# Altium schematic sheet MCU.SchDoc
size A
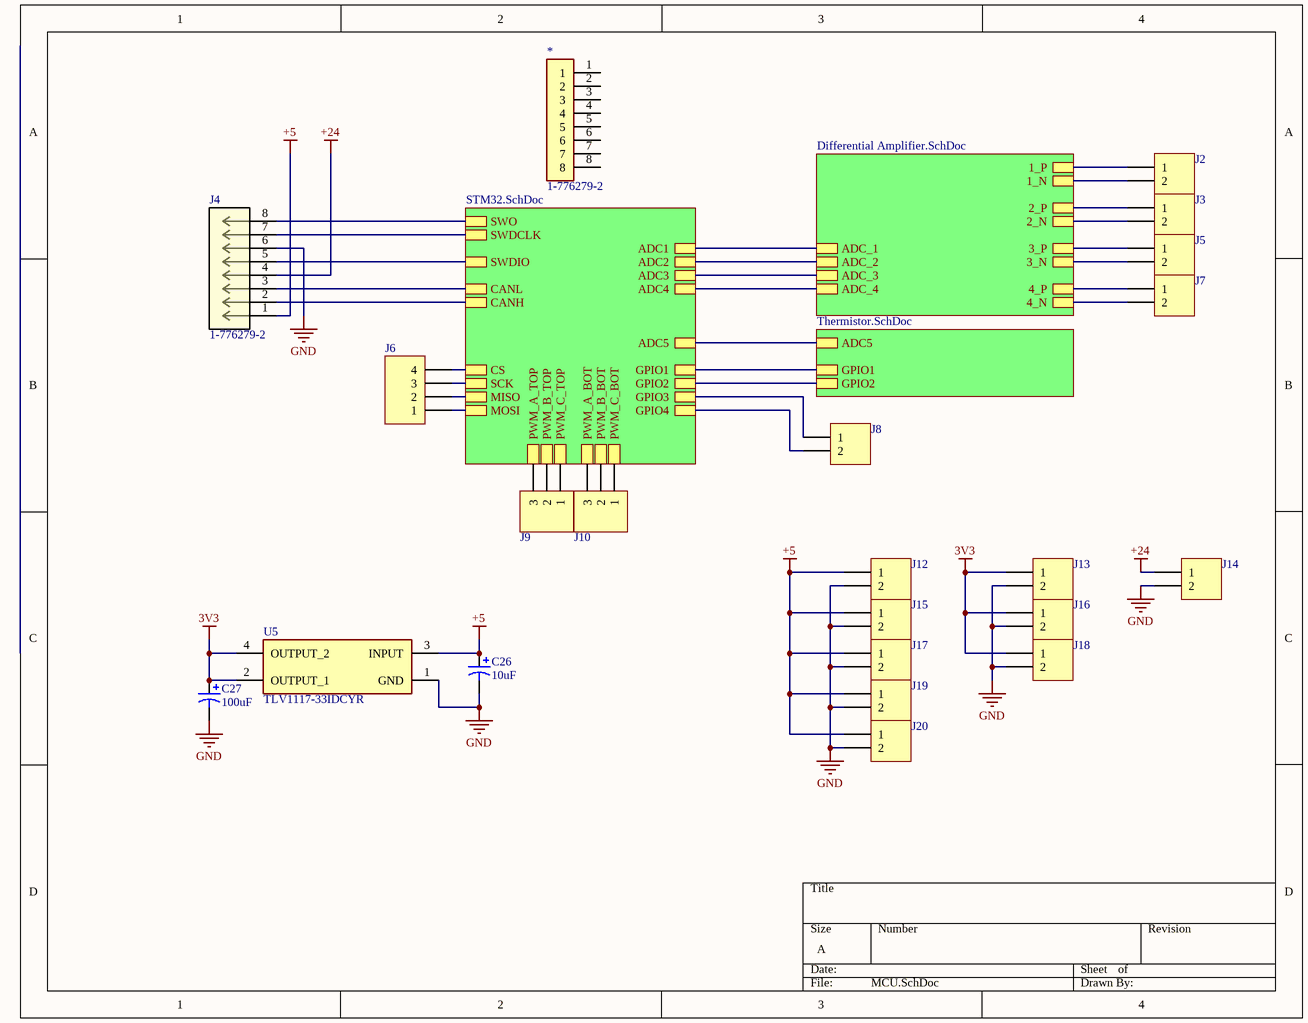
[diagram p0: MCU.SchDoc]

## Parts
*  1-776279-2  [TE_1-776279-2]
C26  value 10uF  [CAPAE660X800N]  (hidden comment: Cap Pol3)
C27  value 100uF  [CAPAE660X800N]  (hidden comment: Cap Pol3)
J2  Header 2  [HDR1X2]  (value not drawn)
J3  Header 2  [HDR1X2]  (value not drawn)
J4  1-776279-2  [CONN8_776279_TEC]
J5  Header 2  [HDR1X2]  (value not drawn)
J6  Header 4  [HDR1X4]  (value not drawn)
J7  Header 2  [HDR1X2]  (value not drawn)
J8  Header 2  [HDR1X2]  (value not drawn)
J9  Header 3  [HDR1X3]  (value not drawn)
J10  Header 3  [HDR1X3]  (value not drawn)
J12  Header 2  [HDR1X2]  (value not drawn)
J13  Header 2  [HDR1X2]  (value not drawn)
J14  Header 2  [HDR1X2]  (value not drawn)
J15  Header 2  [HDR1X2]  (value not drawn)
J16  Header 2  [HDR1X2]  (value not drawn)
J17  Header 2  [HDR1X2]  (value not drawn)
J18  Header 2  [HDR1X2]  (value not drawn)
J19  Header 2  [HDR1X2]  (value not drawn)
J20  Header 2  [HDR1X2]  (value not drawn)
U5  TLV1117-33IDCYR  [SOT230P700X180-4N]

## Sub-sheets
Designator = STM32.SchDoc: ADC1, ADC2, ADC3, ADC4, ADC5, CANH, CANL, GPIO1, GPIO4, GPIO3, GPIO2, PWM_B_BOT, PWM_A_BOT, PWM_B_TOP, PWM_C_BOT, PWM_A_TOP, PWM_C_TOP, CS, MISO, SCK, MOSI, SWDIO, SWO, SWDCLK
Designator = Differential Amplifier.SchDoc: ADC_1, ADC_2, ADC_3, ADC_4, 2_N, 2_P, 3_N, 1_N, 4_P, 1_P, 4_N, 3_P
Designator = Thermistor.SchDoc: ADC5, GPIO1, GPIO2

## Nets
3V3: C27.1 J13.1 J16.1 J18.1 U5.2(OUTPUT_1) U5.4(OUTPUT_2)
+5: C26.1 J4.1 J12.1 J15.1 J17.1 J19.1 J20.1 U5.3(INPUT)
+24: J4.4 J14.1
GND: C26.2 C27.2 J4.6 J12.2 J13.2 J14.2 J15.2 J16.2 J17.2 J18.2 J19.2 J20.2 U5.1(GND)
NetJ2_1: J2.1 ; sheet Designator/1_P
NetJ2_2: J2.2 ; sheet Designator/1_N
NetJ3_1: J3.1 ; sheet Designator/2_P
NetJ3_2: J3.2 ; sheet Designator/2_N
NetJ4_2: J4.2 ; sheet Designator/CANH
NetJ4_3: J4.3 ; sheet Designator/CANL
NetJ4_5: J4.5 ; sheet Designator/SWDIO
NetJ4_7: J4.7 ; sheet Designator/SWDCLK
NetJ4_8: J4.8 ; sheet Designator/SWO
NetJ5_1: J5.1 ; sheet Designator/3_P
NetJ5_2: J5.2 ; sheet Designator/3_N
NetJ6_1: J6.1 ; sheet Designator/MOSI
NetJ6_2: J6.2 ; sheet Designator/MISO
NetJ6_3: J6.3 ; sheet Designator/SCK
NetJ6_4: J6.4 ; sheet Designator/CS
NetJ7_1: J7.1 ; sheet Designator/4_P
NetJ7_2: J7.2 ; sheet Designator/4_N
NetJ8_1: J8.1 ; sheet Designator/GPIO3
NetJ8_2: J8.2 ; sheet Designator/GPIO4
NetJ9_1: J9.1 ; sheet Designator/PWM_C_TOP
NetJ9_2: J9.2 ; sheet Designator/PWM_B_TOP
NetJ9_3: J9.3 ; sheet Designator/PWM_A_TOP
NetJ10_1: J10.1 ; sheet Designator/PWM_C_BOT
NetJ10_2: J10.2 ; sheet Designator/PWM_B_BOT
NetJ10_3: J10.3 ; sheet Designator/PWM_A_BOT
(unnamed): sheet Designator/ADC1, sheet Designator/ADC_1
(unnamed): sheet Designator/ADC2, sheet Designator/ADC_2
(unnamed): sheet Designator/ADC3, sheet Designator/ADC_3
(unnamed): sheet Designator/ADC4, sheet Designator/ADC_4
(unnamed): sheet Designator/ADC5, sheet Designator/ADC5
(unnamed): sheet Designator/GPIO1, sheet Designator/GPIO1
(unnamed): sheet Designator/GPIO2, sheet Designator/GPIO2

Not connected (* = marked no-connect by the designer): * 1 2 3 4 5 6 7 8

## Library data of the parts
C26 C27 = Cap Pol3: Polarized Capacitor (Surface Mount); Published: 8-Jun-2000; LatestRevisionDate: 29-May-2009; LatestRevisionNote: IPC-7351 Footprint Added.; PackageReference: C0805; Publisher: Altium Limited; PackageDescription: Chip Capacitor
J2 J3 J5 J7 J8 J12-J20 = Header 2: Header, 2-Pin; LatestRevisionDate: 17-Jul-2002; LatestRevisionNote: Re-released for DXP Platform.; Publisher: Altium Limited
J4 = 1-776279-2: 8 POS RIGHT ANGLE HEADER ASSY; Vendor: TE Connectivity; ROWS/CONFIG: 3; PITCH(MM): 0.157; POSITIONS: 8; Built_By: EMA_UL_Team; SourceLibrary: TE_Connectivity-2018-03-16; Copyright: Copyright (C) 2016 Accelerated Designs. All rights reserved; Manufacturer_Part_Number: 1-776279-2; TE_Part_Number: 1-776279-2; PRODUCT: -; Type: DEV; RefDes: RefDes
J6 = Header 4: Header, 4-Pin; LatestRevisionDate: 17-Jul-2002; LatestRevisionNote: Re-released for DXP Platform.; Publisher: Altium Limited
J9 J10 = Header 3: Header, 3-Pin; LatestRevisionDate: 17-Jul-2002; LatestRevisionNote: Re-released for DXP Platform.; Publisher: Altium Limited
U5 = TLV1117-33IDCYR: Integrated Circuit; Manufacturer_Name: Texas Instruments; Datasheet Link: http://www.ti.com/lit/ds/symlink/tlv1117.pdf?HQS=TI-null-null-digikeymode-df-pf-null-wwe&ts=1590668900314; Height: 1.8mm; Manufacturer_Part_Number: TLV1117-33IDCYR; Arrow Part Number: TLV1117-33IDCYR; Arrow Price/Stock: https://www.arrow.com/en/products/tlv1117-33idcyr/texas-instruments; Mouser Part Number: 595-TLV1117-33IDCYR; Mouser Price/Stock: https://www.mouser.co.uk/ProductDetail/Texas-Instruments/TLV1117-33IDCYR?qs=p6lVfQR1GSoKgp3tAXcW5w%3D%3D